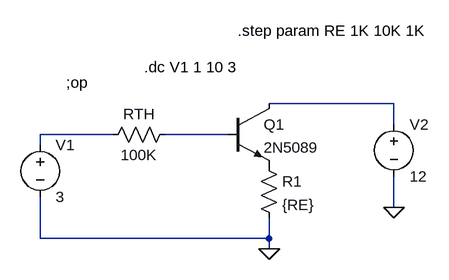
[diagram p0: schematic Bias_RE_Feedback_Testing.asc]
Bias_RE_Feedback_Testing.asc, the LTspice schematic file:
Version 4
SHEET 1 880 680
WIRE 448 128 256 128
WIRE 448 160 448 128
WIRE 16 176 -96 176
WIRE 192 176 96 176
WIRE -96 192 -96 176
WIRE 448 288 448 240
WIRE -96 336 -96 272
WIRE 256 336 256 304
WIRE 256 336 -96 336
WIRE 256 352 256 336
FLAG 448 288 0
FLAG 256 352 0
SYMBOL npn 192 128 R0
SYMATTR InstName Q1
SYMATTR Value 2N5089
SYMBOL res 240 208 R0
SYMATTR InstName R1
SYMATTR Value {RE}
SYMBOL voltage -96 176 R0
WINDOW 123 0 0 Left 0
WINDOW 39 0 0 Left 0
SYMATTR InstName V1
SYMATTR Value 3
SYMBOL voltage 448 144 R0
WINDOW 123 0 0 Left 0
WINDOW 39 0 0 Left 0
SYMATTR InstName V2
SYMATTR Value 12
SYMBOL res 112 160 R90
WINDOW 0 0 56 VBottom 2
WINDOW 3 32 56 VTop 2
SYMATTR InstName RTH
SYMATTR Value 100K
TEXT -56 96 Left 2 !;op
TEXT 64 72 Left 2 !.dc V1 1 10 3
TEXT 208 16 Left 2 !.step param RE 1K 10K 1K

The netlist it stands for:
* Bias_RE_Feedback_Testing.asc
Q1 N001 N003 P001 0 2N5089
R1 P001 0 {RE}
V1 N002 0 3
V2 N001 0 12
RTH N003 N002 100K
.model NPN NPN
.model PNP PNP
.lib standard.bjt
;op
.dc V1 1 10 3
.step param RE 1K 10K 1K
.backanno
.end